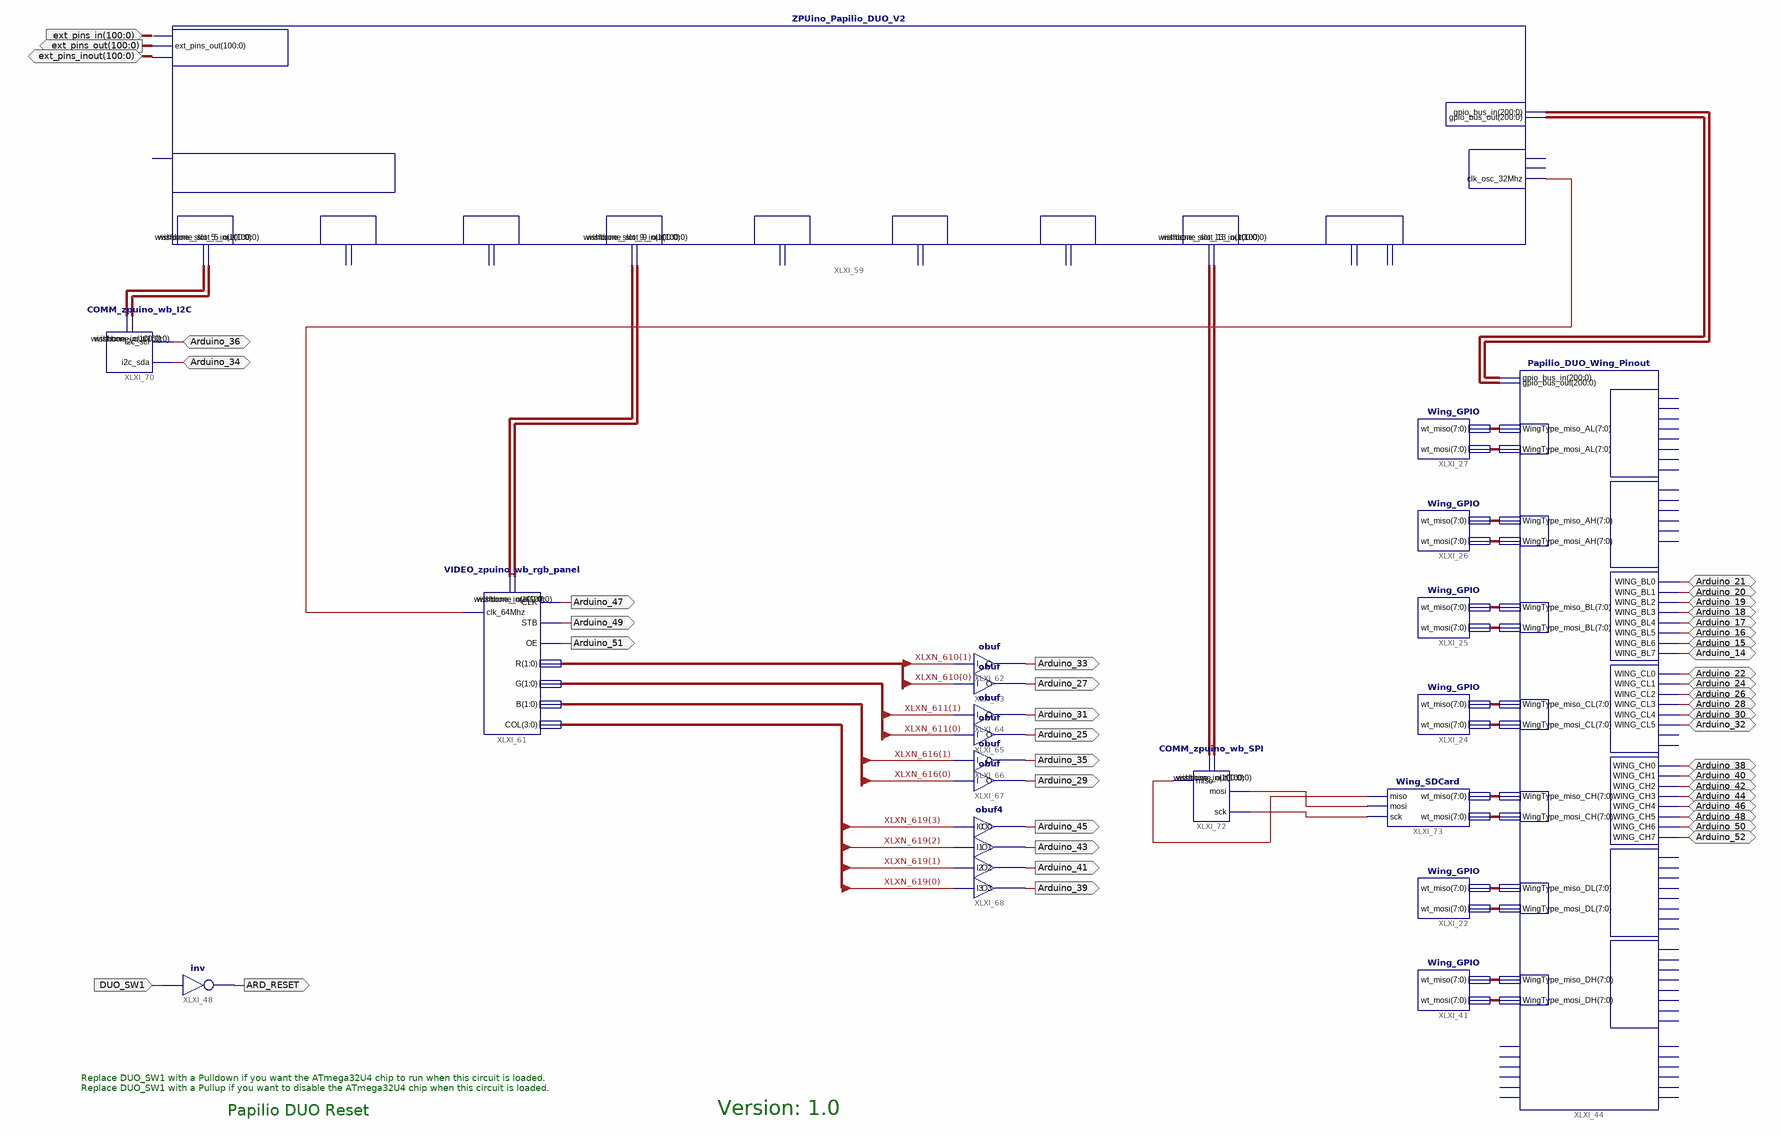
[diagram p0: schematic sheet 1]
// Xilinx ISE schematic Papilio_DUO_LX9.sch (spartan6) as structural Verilog: 20 symbols, 42 ports
module Papilio_DUO_LX9 (
  input  [100:0] ext_pins_in,
  input  DUO_SW1,
  inout  [100:0] ext_pins_inout,
  inout  Arduino_21,
  inout  Arduino_20,
  inout  Arduino_19,
  inout  Arduino_18,
  inout  Arduino_17,
  inout  Arduino_16,
  inout  Arduino_15,
  inout  Arduino_14,
  inout  Arduino_22,
  inout  Arduino_24,
  inout  Arduino_26,
  inout  Arduino_28,
  inout  Arduino_30,
  inout  Arduino_32,
  inout  Arduino_34,
  inout  Arduino_36,
  inout  Arduino_38,
  inout  Arduino_40,
  inout  Arduino_42,
  inout  Arduino_44,
  inout  Arduino_46,
  inout  Arduino_48,
  inout  Arduino_50,
  inout  Arduino_52,
  output [100:0] ext_pins_out,
  output ARD_RESET,
  output Arduino_47,
  output Arduino_49,
  output Arduino_51,
  output Arduino_33,
  output Arduino_29,
  output Arduino_31,
  output Arduino_25,
  output Arduino_35,
  output Arduino_45,
  output Arduino_43,
  output Arduino_41,
  output Arduino_39,
  output Arduino_27
);

  wire XLXN_621, XLXN_635, XLXN_636, XLXN_637;
  wire [1:0] XLXN_610, XLXN_611, XLXN_616;
  wire [3:0] XLXN_619;
  wire [7:0] XLXN_325, XLXN_326, XLXN_329, XLXN_330, XLXN_331, XLXN_332, XLXN_333, XLXN_334, XLXN_335,
       XLXN_336, XLXN_448, XLXN_449, XLXN_632, XLXN_633;
  wire [100:0] XLXN_622, XLXN_623, XLXN_626, XLXN_627, XLXN_630, XLXN_631;
  wire [200:0] XLXN_598, XLXN_599;

  ZPUino_Papilio_DUO_V2 XLXI_59 (
    .gpio_bus_out(XLXN_599), .gpio_bus_in(XLXN_598), .clk_osc_32Mhz(XLXN_621), .ext_pins_in(ext_pins_in),
    .ext_pins_out(ext_pins_out), .ext_pins_inout(ext_pins_inout), .wishbone_slot_5_out(XLXN_627),
    .wishbone_slot_5_in(XLXN_626), .wishbone_slot_9_in(XLXN_622), .wishbone_slot_9_out(XLXN_623),
    .wishbone_slot_13_in(XLXN_630), .wishbone_slot_13_out(XLXN_631));  // open: clk_96Mhz, clk_1Mhz, AVR_Wishbone_Bridge_Enable, wishbone_slot_6_in, wishbone_slot_6_out, wishbone_slot_8_in, wishbone_slot_8_out, wishbone_slot_10_in, wishbone_slot_10_out, wishbone_slot_11_in, wishbone_slot_11_out, wishbone_slot_12_in, wishbone_slot_12_out, wishbone_slot_14_in, wishbone_slot_14_out, wishbone_slot_video_in, wishbone_slot_video_out
  not XLXI_48 (ARD_RESET, DUO_SW1);
  Wing_GPIO XLXI_27 (.wt_miso(XLXN_335), .wt_mosi(XLXN_336));
  Wing_GPIO XLXI_26 (.wt_miso(XLXN_333), .wt_mosi(XLXN_334));
  Wing_GPIO XLXI_25 (.wt_miso(XLXN_331), .wt_mosi(XLXN_332));
  Wing_GPIO XLXI_24 (.wt_miso(XLXN_329), .wt_mosi(XLXN_330));
  Wing_GPIO XLXI_22 (.wt_miso(XLXN_325), .wt_mosi(XLXN_326));
  Wing_GPIO XLXI_41 (.wt_miso(XLXN_448), .wt_mosi(XLXN_449));
  Papilio_DUO_Wing_Pinout XLXI_44 (
    .WING_BL0(Arduino_21), .WING_BL1(Arduino_20), .WING_BL2(Arduino_19), .WING_BL3(Arduino_18),
    .WING_BL4(Arduino_17), .WING_BL5(Arduino_16), .WING_BL6(Arduino_15), .WING_BL7(Arduino_14),
    .gpio_bus_out(XLXN_599), .gpio_bus_in(XLXN_598), .WingType_miso_BL(XLXN_331),
    .WingType_miso_AH(XLXN_333), .WingType_mosi_BL(XLXN_332), .WingType_mosi_AH(XLXN_334),
    .WingType_mosi_AL(XLXN_336), .WingType_miso_AL(XLXN_335), .WING_CL0(Arduino_22), .WING_CL1(Arduino_24),
    .WING_CL2(Arduino_26), .WING_CL3(Arduino_28), .WING_CL4(Arduino_30), .WING_CL5(Arduino_32),
    .WING_CH0(Arduino_38), .WING_CH1(Arduino_40), .WING_CH2(Arduino_42), .WING_CH3(Arduino_44),
    .WING_CH4(Arduino_46), .WING_CH5(Arduino_48), .WING_CH6(Arduino_50), .WING_CH7(Arduino_52),
    .WingType_mosi_CL(XLXN_330), .WingType_miso_CL(XLXN_329), .WingType_miso_CH(XLXN_632),
    .WingType_mosi_CH(XLXN_633), .WingType_mosi_DL(XLXN_326), .WingType_mosi_DH(XLXN_449),
    .WingType_miso_DH(XLXN_448), .WingType_miso_DL(XLXN_325));  // open: WING_AH0, WING_AH1, WING_AH2, WING_AH3, WING_AH4, WING_AH5, WING_AL0, WING_AL1, WING_AL2, WING_AL3, WING_AL4, WING_AL5, WING_CL6, WING_CL7, WING_DL0, WING_DL1, WING_DL2, WING_DL3, WING_DL4, WING_DL5, WING_DL6, WING_DL7, WING_DH0, WING_DH1, WING_DH2, WING_DH3, WING_DH4, WING_DH5, WING_DH6, WING_DH7, WING_AL7, WING_AL6, Flex_Pin_out_0, Flex_Pin_out_1, Flex_Pin_out_2, Flex_Pin_out_3, Flex_Pin_out_4, Flex_Pin_out_5, Flex_Pin_in_0, Flex_Pin_in_1, Flex_Pin_in_2, Flex_Pin_in_3, Flex_Pin_in_4, Flex_Pin_in_5
  VIDEO_zpuino_wb_rgb_panel XLXI_61 (
    .R(XLXN_610), .G(XLXN_611), .B(XLXN_616), .COL(XLXN_619), .CLK(Arduino_47), .STB(Arduino_49),
    .OE(Arduino_51), .wishbone_out(XLXN_623), .wishbone_in(XLXN_622), .clk_64Mhz(XLXN_621));
  obuf XLXI_62 (.I(XLXN_610[1]), .O(Arduino_33));
  obuf XLXI_63 (.I(XLXN_610[0]), .O(Arduino_27));
  obuf XLXI_64 (.I(XLXN_611[1]), .O(Arduino_31));
  obuf XLXI_65 (.I(XLXN_611[0]), .O(Arduino_25));
  obuf XLXI_66 (.I(XLXN_616[1]), .O(Arduino_35));
  obuf XLXI_67 (.I(XLXN_616[0]), .O(Arduino_29));
  obuf4 XLXI_68 (
    .I0(XLXN_619[3]), .I1(XLXN_619[2]), .I2(XLXN_619[1]), .I3(XLXN_619[0]), .O0(Arduino_45), .O1(Arduino_43),
    .O2(Arduino_41), .O3(Arduino_39));
  COMM_zpuino_wb_I2C XLXI_70 (
    .i2c_scl(Arduino_36), .i2c_sda(Arduino_34), .wishbone_in(XLXN_626), .wishbone_out(XLXN_627));
  COMM_zpuino_wb_SPI XLXI_72 (
    .miso(XLXN_637), .sck(XLXN_635), .mosi(XLXN_636), .wishbone_in(XLXN_630), .wishbone_out(XLXN_631));
  Wing_SDCard XLXI_73 (.wt_miso(XLXN_632), .wt_mosi(XLXN_633), .sck(XLXN_635), .mosi(XLXN_636), .miso(XLXN_637));

  // Notes on the sheet:
  //   Replace DUO_SW1 with a Pulldown if you want the ATmega32U4 chip to run when this circuit is loaded.
  //   Replace DUO_SW1 with a Pullup if you want to disable the ATmega32U4 chip when this circuit is loaded.
  //   Version: 1.0
  //   Papilio DUO Reset
endmodule
